# Altium schematic sheet GTM_BallGrippersDiodesConnectors.SchDoc: Ball Gripper's Diodes Connectors
size A4; DrawnBy: Tadeusz Golczyk
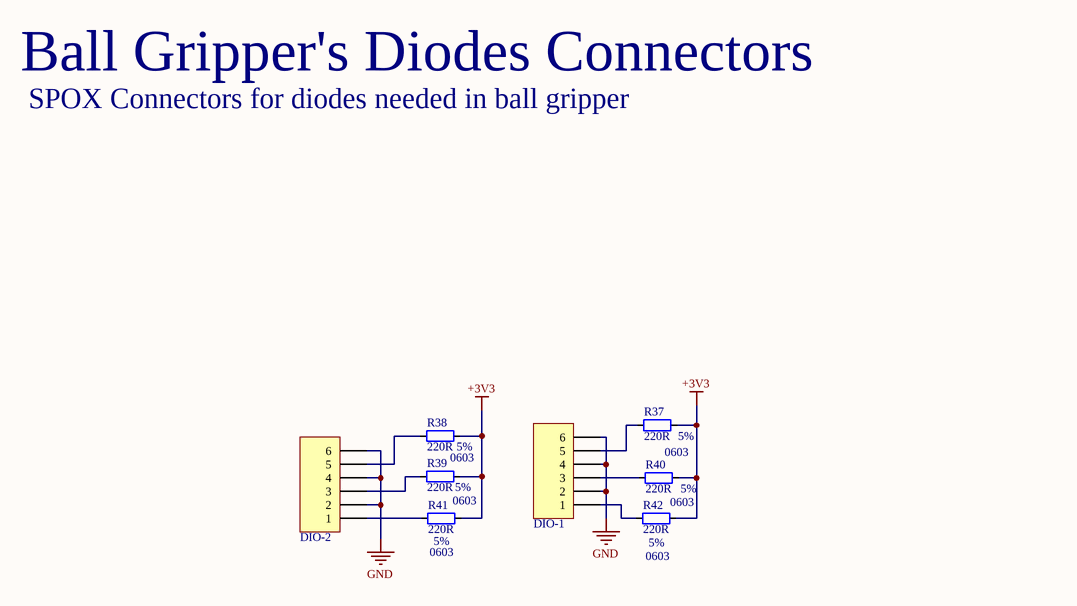
[diagram p0: GTM_BallGrippersDiodesConnectors.SchDoc]

## Parts
DIO-1  HDR1X6  [Molex SPOX Horizontal 6 Circuits]  (value not drawn)
DIO-2  HDR1X6  [Molex SPOX Horizontal 6 Circuits]  (value not drawn)
R37  Tolerance: 5%  [0603]  (hidden comment: 220R)
R38  Tolerance: 5%  [0603]  (hidden comment: 220R)
R39  Tolerance: 5%  [0603]  (hidden comment: 220R)
R40  Tolerance: 5%  [0603]  (hidden comment: 220R)
R41  Tolerance: 5%  [0603]  (hidden comment: 220R)
R42  Tolerance: 5%  [0603]  (hidden comment: 220R)

## Nets
+3V3: R37.1 R38.1 R39.1 R40.1 R41.1 R42.1
GND: DIO-1.2 DIO-1.4 DIO-1.6 DIO-2.2 DIO-2.4 DIO-2.6
NetDIO-1_1: DIO-1.1 R42.2
NetDIO-1_3: DIO-1.3 R40.2
NetDIO-1_5: DIO-1.5 R37.2
NetDIO-2_1: DIO-2.1 R41.2
NetDIO-2_3: DIO-2.3 R39.2
NetDIO-2_5: DIO-2.5 R38.2

## Notes on the sheet
- Ball Gripper's Diodes Connectors
- SPOX Connectors for diodes needed in ball gripper
- Project
- Rev.
- Title
- Drawn by
- Date
- Sheet
- of
- Checked by

## Library data of the parts
DIO-1 DIO-2 = HDR1X6: Header, 6-Pin; LatestRevisionDate: 17-Jul-2002; LatestRevisionNote: Re-released for DXP Platform.; Publisher: Altium Limited
R37-R42 = RES: Resistior; Value: 220R; Package: 0603